# EAGLE design oec (EAGLE 6.2)
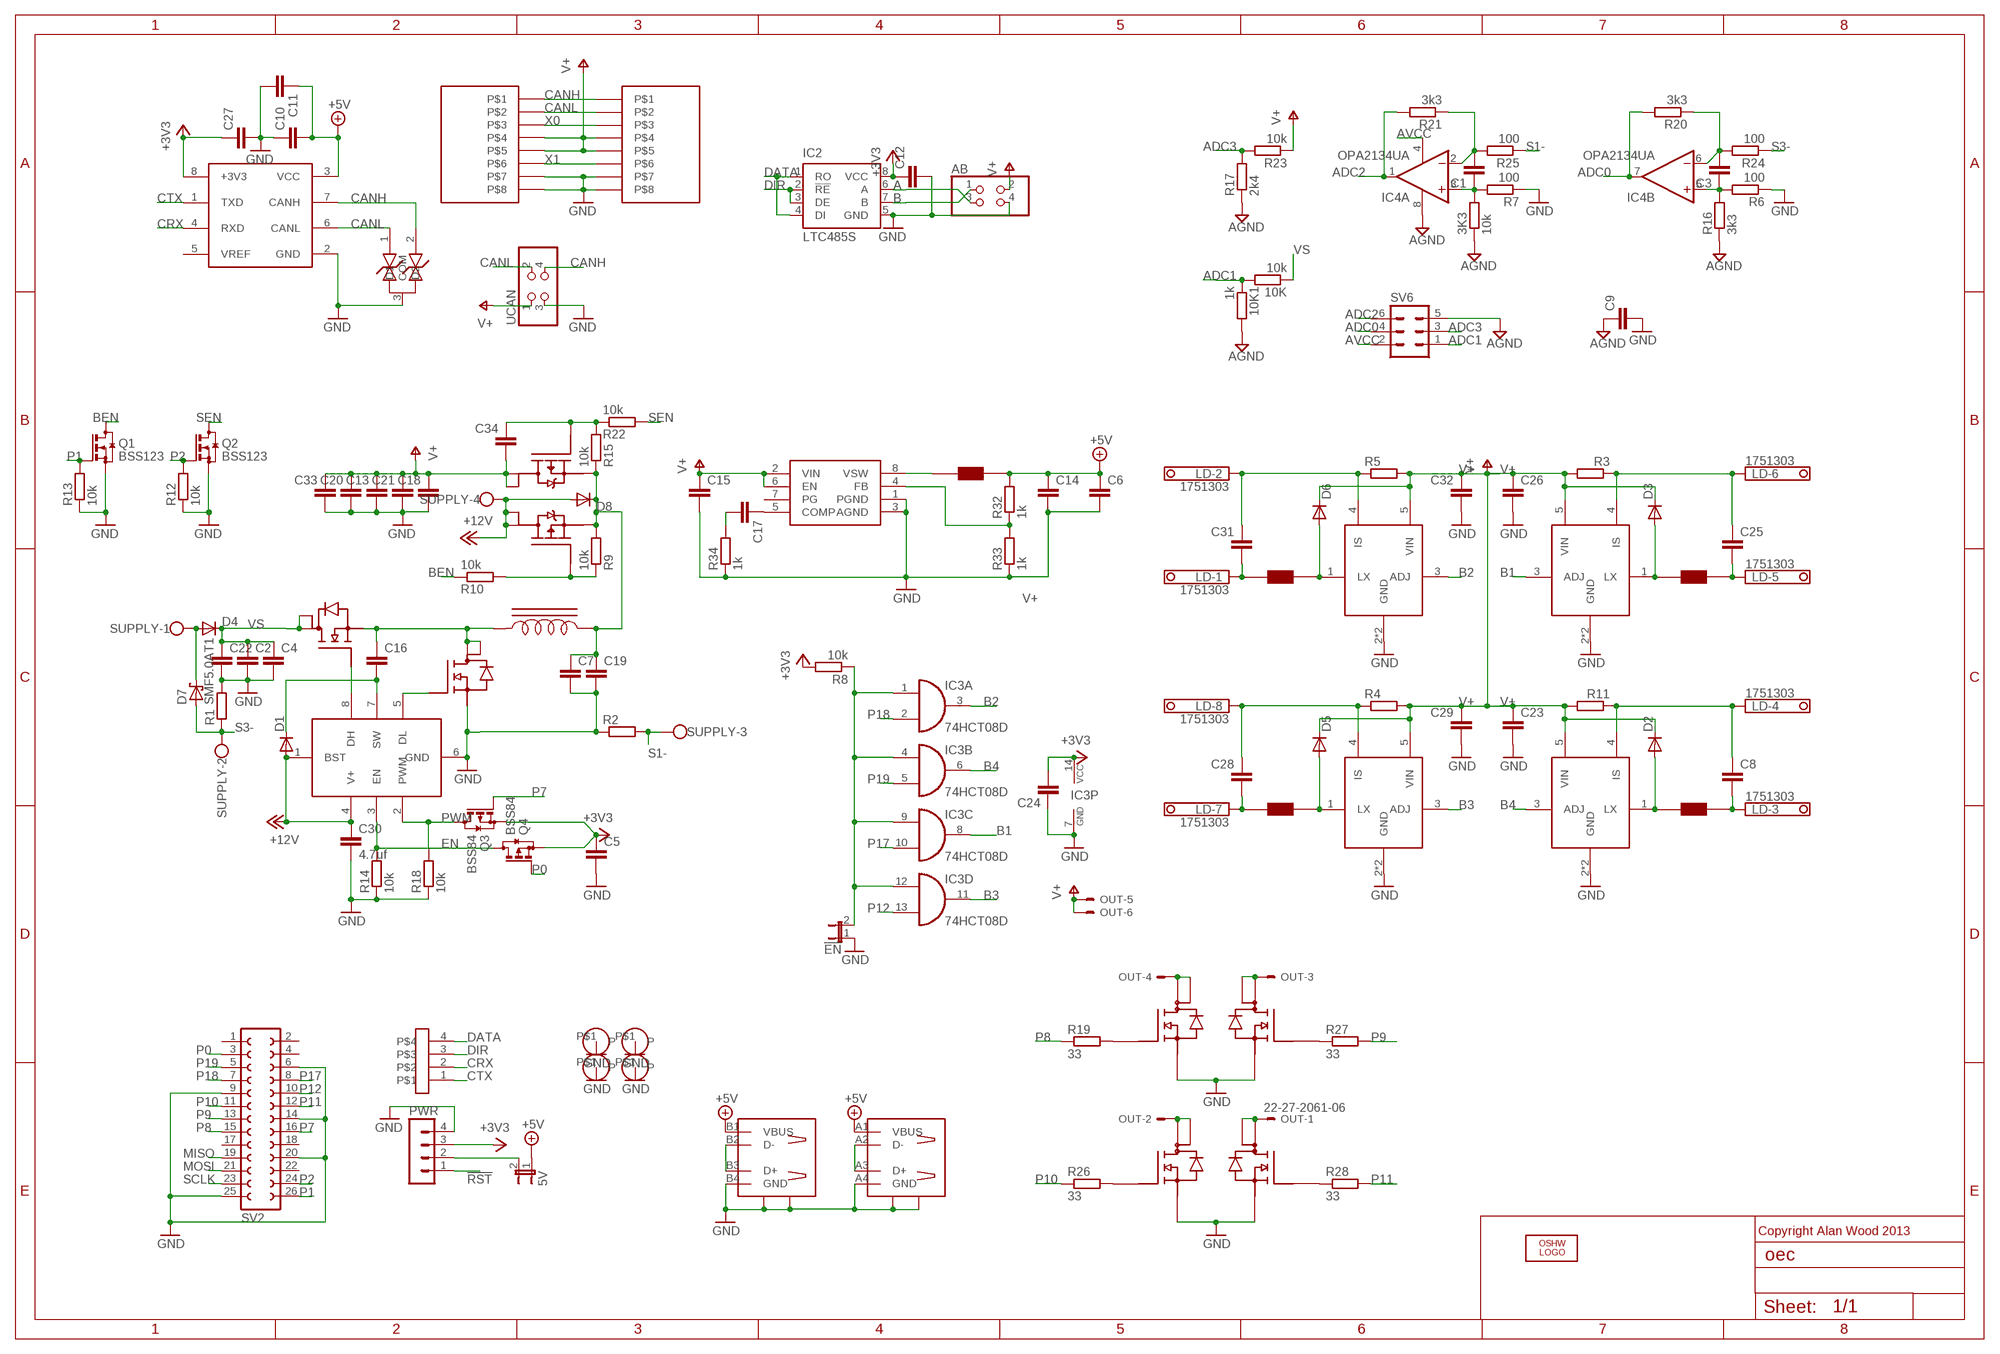
[diagram p0: schematic, sheet 1]

## Parts
3K3  10k  R-EU_R0805  [R0805]
5V  JP1E  [JP1]
10K  10k  R-EU_R0805  [R0805]
10K1  1k  R-EU_R0805  [R0805]
!EN  JP1E  [JP1]
AB  PINHD-2X2/90  [2X02/90]
C1  C-EUC0805  [C0805]
C2  C-EUC1210  [C1210]
C3  C-EUC0805  [C0805]
C4  C-EUC1210  [C1210]
C5  C-EUC0805  [C0805]
C6  C-EUC1210  [C1210]
C7  C-EUC1210  [C1210]
C8  C-EUC1210  [C1210]
C9  C-EUC0805  [C0805]
C10  C-EUC1210  [C1210]
C11  C-EUC1210  [C1210]
C12  C-EUC0805  [C0805]
C13  C-EUC1210  [C1210]
C14  C-EUC1210  [C1210]
C15  C-EUC0805  [C0805]
C16  C-EUC0805  [C0805]
C17  C-EUC0805  [C0805]
C18  C-EUC1210  [C1210]
C19  C-EUC1210  [C1210]
C20  C-EUC1210  [C1210]
C21  C-EUC1210  [C1210]
C22  C-EUC1210  [C1210]
C23  C-EUC1210  [C1210]
C24  C-EUC0805  [C0805]
C25  C-EUC1210  [C1210]
C26  C-EUC1210  [C1210]
C27  C-EUC0805  [C0805]
C28  C-EUC1210  [C1210]
C29  C-EUC1210  [C1210]
C30  4.7uf  C-EUC0805  [C0805]
C31  C-EUC1210  [C1210]
C32  C-EUC1210  [C1210]
C33  C-EUC1210  [C1210]
C34  C-EUC0805  [C0805]
COM  4X1X2.54-HEADER  [2.54_HEADER_4W]
D1  DIODE-SOD123  [SOD123]
D2  DIODE-SOD123  [SOD123]
D3  DIODE-SOD123  [SOD123]
D4  DIODE-DO214AC  [DO214AC]
D5  DIODE-SOD123  [SOD123]
D6  DIODE-SOD123  [SOD123]
D7  SMF5.0AT1  [SOD123FL]
D8  DIODE-DO214AC  [DO214AC]
IC2  LTC485S  [SOIC8]
IC3  74HCT08D  [SO14]
IC4  OPA2134UA  [SO08]
LD  1751303  [1751303]
LOGO1  OSHW_LOGO_FILLX0200-NT  [OSHW_FILLX200_NOTEXT]
OUT  22-27-2061-06  [6410-06]
PWR  MA04-1  [MA04-1]
Q1  BSS123  [SOT23]
Q2  BSS123  [SOT23]
Q3  BSS84  [SOT23]
Q4  BSS84  [SOT23]
R1  R-EU_R1206  [R1206]
R2  R-EU_R1206  [R1206]
R3  R-EU_R1210  [R1210]
R4  R-EU_R1210  [R1210]
R5  R-EU_R1210  [R1210]
R6  100  R-EU_R0805  [R0805]
R7  100  R-EU_R0805  [R0805]
R8  10k  R-EU_R0805  [R0805]
R9  10k  R-EU_R0805  [R0805]
R10  10k  R-EU_R0805  [R0805]
R11  R-EU_R1210  [R1210]
R12  10k  R-EU_R0805  [R0805]
R13  10k  R-EU_R0805  [R0805]
R14  10k  R-EU_R0805  [R0805]
R15  10k  R-EU_R0805  [R0805]
R16  3k3  R-EU_R0805  [R0805]
R17  2k4  R-EU_R0805  [R0805]
R18  10k  R-EU_R0805  [R0805]
R19  33  R-EU_R0603  [R0603]
R20  3k3  R-EU_R0805  [R0805]
R21  3k3  R-EU_R0805  [R0805]
R22  10k  R-EU_R0805  [R0805]
R23  10k  R-EU_R0805  [R0805]
R24  100  R-EU_R0805  [R0805]
R25  100  R-EU_R0805  [R0805]
R26  33  R-EU_R0603  [R0603]
R27  33  R-EU_R0603  [R0603]
R28  33  R-EU_R0603  [R0603]
R32  1k  R-EU_R0805  [R0805]
R33  1k  R-EU_R0805  [R0805]
R34  1k  R-EU_R0805  [R0805]
SUPPLY  W237-4  [W237-4]
SV2  FE13-2  [FE13-2]
SV6  MA03-2  [MA03-2]
U$1  HOLE-2.5MM  [2.5MM-HOLE]
U$2  HOLE-2.5MM  [2.5MM-HOLE]
U$3  HOLE-2.5MM  [2.5MM-HOLE]
U$4  HOLE-2.5MM  [2.5MM-HOLE]
U$5  NCP3170SOIC-8  [SOIC-8-NARROW]
U$6  NTMD4820NR2G  [SOIC-8-NARROW]
U$7  AMIS-3063  [SOIC-8-NARROW]
U$8  NTMD4820NR2G  [SOIC-8-NARROW]
U$9  NRS6045T330MMGK  [TAIKO-YUDEN-6045]
U$12  NCP3420  [SO8]
U$13  RJHSE-5080  [RJ45]
U$14  RJHSE-5080  [RJ45]
U$15  DR127-XXX  [DR127]
U$16  DUAL-USBA-PTH-5787617-1  [DUAL-USBA-PTH]
U$17  NUP2105L  [SOT23]
U$19  SI49255DD  [SO8]
U$20  IRF9358PBF  [SO8]
U$25  ZLED7X20  [SOT89-5]
U$27  ZLED7X20  [SOT89-5]
U$29  ZLED7X20  [SOT89-5]
U$31  ZLED7X20  [SOT89-5]
U$33  NR5040T330M  [TAIKO-YUDEN-5040]
U$34  NR5040T330M  [TAIKO-YUDEN-5040]
U$35  NR5040T330M  [TAIKO-YUDEN-5040]
U$36  NR5040T330M  [TAIKO-YUDEN-5040]
UCAN  PINHD-2X2  [2X02]

## Nets
!RST: PWR.1
+3V3: C5.1 C12.1 C24.2 C27.1 IC2.8(VCC) IC3.14(P:VCC) PWR.3 Q3.2(S) Q4.2(S) R8.2 U$7.8(+3V3)
+5V: 5V.1 C6.1 C10.2 C11.1 C14.1 R32.2 U$7.3(VCC) U$9.2 U$16.A1(VBUS) U$16.B1(VBUS)
+12V: C30.1 D1.A D8.A SUPPLY.4 U$12.1(BST) U$12.4(V+) U$19.7(D) U$19.8(D)
A: AB.3 IC2.6(A)
ADC0: IC4.7(B:OUT) R20.2 SV6.4
ADC1: 10K1.1 10K.2 SV6.1
ADC2: IC4.1(A:OUT) R21.2 SV6.6
ADC3: R17.2 R23.2 SV6.3
AGND: 3K3.1 10K1.2 C9.1 IC4.8(A:V+) R16.1 R17.1 SV6.5
AVCC: IC4.4(A:V-) SV6.2
B: AB.1 IC2.7(B)
B1: IC3.8(C:O) U$27.3(ADJ)
B2: IC3.3(A:O) U$31.3(ADJ)
B3: IC3.11(D:O) U$29.3(ADJ)
B4: IC3.6(B:O) U$25.3(ADJ)
BATTEN: R9.1 R10.2 U$19.2(G)
BEN: Q1.3(D) R10.1
CANH: U$7.7(CANH) U$13.P$1 U$14.P$1 U$17.2(D2) UCAN.4
CANL: U$7.6(CANL) U$13.P$2 U$14.P$2 U$17.1(D1) UCAN.2
CRX: COM.2 U$7.4(RXD)
CTX: COM.1 U$7.1(TXD)
DATA: COM.4 IC2.1(RO) IC2.4(DI)
DIR: COM.3 IC2.2(!RE) IC2.3(DE)
EN: Q4.3(D) R14.2 U$12.3(EN)
GND: !EN.1 AB.4 C2.2 C4.2 C5.2 C6.2 C7.2 C9.2 C10.1 C11.2 C12.2 C13.2 C14.2 C15.2 C18.2 C19.2 C20.2 C21.2 C22.2 C23.2 C24.1 C26.2 C27.2 C29.2 C30.2 C32.2 C33.2 IC2.5(GND) IC3.7(P:GND) PWR.4 Q1.2(S) Q2.2(S) R1.2 R2.1 R6.1 R7.1 R12.1 R13.1 R14.1 R18.1 R33.1 R34.1 SV2.6 SV2.9 SV2.14 SV2.20 SV2.25 U$1.P$1(P) U$2.P$1(P) U$3.P$1(P) U$4.P$1(P) U$5.1(PGND) U$5.3(AGND) U$6.1(S1) U$6.3(S2) U$7.2(GND) U$8.1(S1) U$8.3(S2) U$12.6(GND) U$13.P$7 U$13.P$8 U$14.P$7 U$14.P$8 U$16.A4(GND) U$16.B4(GND) U$16.SH2B(SH) U$16.SH@1A(SH) U$16.SH@1B(SH) U$16.SH@2A(SH) U$17.3(COM) U$20.3(S) U$25.2(GND) U$25.2@1(GND) U$27.2(GND) U$27.2@1(GND) U$29.2(GND) U$29.2@1(GND) U$31.2(GND) U$31.2@1(GND) UCAN.3
ID: C16.1 U$15.P$1(L1) U$20.1(S) U$20.5(D) U$20.6(D)
MISO: SV2.19
MOSI: SV2.21
N$1: C17.1 U$5.5(COMP)
N$2: !EN.2 IC3.1(A:I0) IC3.4(B:I0) IC3.9(C:I0) IC3.12(D:I0) R8.1
N$3: D2.A U$25.1(LX) U$36.1
N$4: R19.2 U$6.2(G1)
N$5: C8.2 LD.3 U$36.2
N$6: U$5.8(VSW) U$9.1
N$7: OUT.4 U$6.7(DP1) U$6.8(D1)
N$8: U$12.8(DH) U$20.2(G)
N$9: R26.2 U$8.2(G1)
N$10: C8.1 LD.4 R11.1 U$25.4(IS)
N$11: D5.A U$29.1(LX) U$35.2
N$12: U$12.5(DL) U$20.4(G)
N$13: C16.2 D1.C U$12.7(SW)
N$14: R28.1 U$8.4(G2)
N$15: OUT.3 U$6.5(DP2) U$6.6(D2)
N$16: R27.1 U$6.4(G2)
N$18: OUT.2 U$8.7(DP1) U$8.8(D1)
N$19: OUT.1 U$8.5(DP2) U$8.6(D2)
N$20: U$16.B2(D-) U$16.B3(D+)
N$22: R32.1 R33.2 U$5.4(FB)
N$23: U$16.A2(D-) U$16.A3(D+)
N$24: D4.A D7.C SUPPLY.1
N$26: 3K3.2 C1.1 IC4.3(A:+IN) R7.2
N$27: C3.1 IC4.5(B:+IN) R6.2 R16.2
N$28: C34.1 R15.2 R22.1 U$19.4(G)
N$29: D3.A U$27.1(LX) U$34.1
N$31: C17.2 R34.2
N$32: C25.2 LD.5 U$34.2
N$38: C1.2 IC4.2(A:-IN) R21.1 R25.2
N$40: C3.2 IC4.6(B:-IN) R20.1 R24.2
N$41: C25.1 LD.6 R3.1 U$27.4(IS)
N$54: C28.2 LD.7 U$35.1
N$56: C28.1 LD.8 R4.1 U$29.4(IS)
N$57: D6.A U$31.1(LX) U$33.2
N$58: C31.2 LD.1 U$33.1
N$59: C31.1 LD.2 R5.1 U$31.4(IS)
P0: Q4.1(G) SV2.3
P1: Q1.1(G) R13.2 SV2.26
P2: Q2.1(G) R12.2 SV2.24
P7: Q3.1(G) SV2.16
P8: R19.1 SV2.15
P9: R27.2 SV2.13
P10: R26.1 SV2.11
P11: R28.2 SV2.12
P12: IC3.13(D:I1) SV2.10
P17: IC3.10(C:I1) SV2.8
P18: IC3.2(A:I1) SV2.7
P19: IC3.5(B:I1) SV2.5
PWM: Q3.3(D) R18.2 U$12.2(PWM)
S1-: R2.2 R25.1 SUPPLY.3
S3-: D7.A R1.1 R24.1 SUPPLY.2
SCLK: SV2.23
SEN: Q2.3(D) R22.2
V+: AB.2 C13.1 C15.1 C18.1 C20.1 C21.1 C23.1 C26.1 C29.1 C32.1 C33.1 C34.2 D2.C D3.C D5.C D6.C OUT.5 OUT.6 R3.2 R4.2 R5.2 R11.2 R23.1 U$5.2(VIN) U$5.6(EN) U$13.P$4 U$13.P$5 U$14.P$4 U$14.P$5 U$19.5(D) U$19.6(D) U$25.5(VIN) U$27.5(VIN) U$29.5(VIN) U$31.5(VIN) UCAN.1
VBUCK: C7.1 C19.1 D8.C R9.2 R15.1 U$15.P$2(L2) U$19.1(S) U$19.3(S)
VISB: 5V.2 PWR.2
VS: 10K.1 C2.1 C4.1 C22.1 D4.C U$20.7(D) U$20.8(D)
X0: U$13.P$3 U$14.P$3
X1: U$13.P$6 U$14.P$6
Unconnected: SV2.1 SV2.2 SV2.4 SV2.17 SV2.18 SV2.22 U$5.7(PG) U$7.5(VREF)

## Notes on the sheet
- Copyright Alan Wood 2013

## Library data of the parts
3K3 10K 10K1 R6-R10 R12-R18 R20-R25 R32-R34 = rcl:R-EU_: RESISTOR, European symbol
5V !EN = jumper:JP1E: JUMPER
AB UCAN = pinhead:PINHD-2X2: PIN HEADER
C1-C34 = rcl:C-EU: CAPACITOR, European symbol
COM = amino:4X1X2.54-HEADER
D1-D6 D8 = diode:DIODE-: DIODE
D7 = diode:SMF5.0AT1: 200 W Transient Voltage Suppressor Source: Data sheet <http://www.onsemi.com/pub_link/Collateral/SMF5.0AT1-D.PDF>
IC2 = linear-technology:LTC485: Low Power RS485 Interface Transceiver Source: http://www.linear.com/pc/downloadDocument.do?navId=H0,C1,C1007,C1017,P2064,D1718; OC_FARNELL: unknown; OC_NEWARK: unknown
IC3 = 74xx-eu:74*08: Quad 2-input AND gate
IC4 = linear:OPA2*: Dual Operational Amplifier Low Power, Single-Supply, Rail-To-Rail Operational Amplifier Source: http://focus.ti.com/lit/ds/symlink/opa2345.pdf http://focus.ti.com .. opa241.pdf http://focus.ti.com/lit/ds/symlink/opa2134.pdf
LD = con-phoenix-350:1751303: MKDS 1/ 8-3,5 Printklemme Nennstrom: 10 A Bemessungsspannung: 160 V Raster: 3,5 mm Polzahl: 8 Montageart: Löten Anschlussart: Schraubanschluss Anschlussrichtung vom Leiter zur Platine: 0° Source: http://eshop.phoenixcontact.com .. .pdf; OC_FARNELL: unknown; OC_NEWARK: unknown
LOGO1 = ohw-logo:OSHW_LOGO_FILL
OUT = con-molex:22-?-06: CONNECTOR wire to board 2.54 mm (.1 inch) pitch header; OC_FARNELL: unknown; OC_NEWARK: unknown
PWR = con-lstb:MA04-1: PIN HEADER; OC_FARNELL: unknown; OC_NEWARK: unknown
Q1 Q2 = transistor-small-signal:BSS123: N-CHANNEL MOS FET
Q3 Q4 = transistor-small-signal:BSS84: P-CHANNEL MOS FET
R1-R5 R11 R19 R26-R28 = resistor:R-EU_: RESISTOR, European symbol
SUPPLY = con-wago-500:W237-4: WAGO SCREW CLAMP; OC_FARNELL: unknown; OC_NEWARK: unknown
SV2 = con-lsta:FE13-2: FEMALE HEADER; OC_FARNELL: unknown; OC_NEWARK: unknown
SV6 = con-lstb:MA03-2: PIN HEADER; OC_FARNELL: unknown; OC_NEWARK: unknown
U$1-U$4 = amino:HOLE-2.5MM
U$5 = amino:NCP3170
U$6 U$8 = amino:NTMD4820NR2G
U$7 = amino:AMIS-3063
U$9 = amino:NRS6045T330MMGK
U$12 = amino:NCP3420
U$13 U$14 = amino:RJHSE-5080
U$15 = amino:DR127-XXX
U$16 = amino:DUAL-USBA-PTH-5787617-1
U$17 = amino:NUP2105L
U$19 = amino:SI49255DD
U$20 = amino:IRF9358PBF
U$25 U$27 U$29 U$31 = amino:ZLED7X20
U$33-U$36 = amino:NR5040T330M

## Board
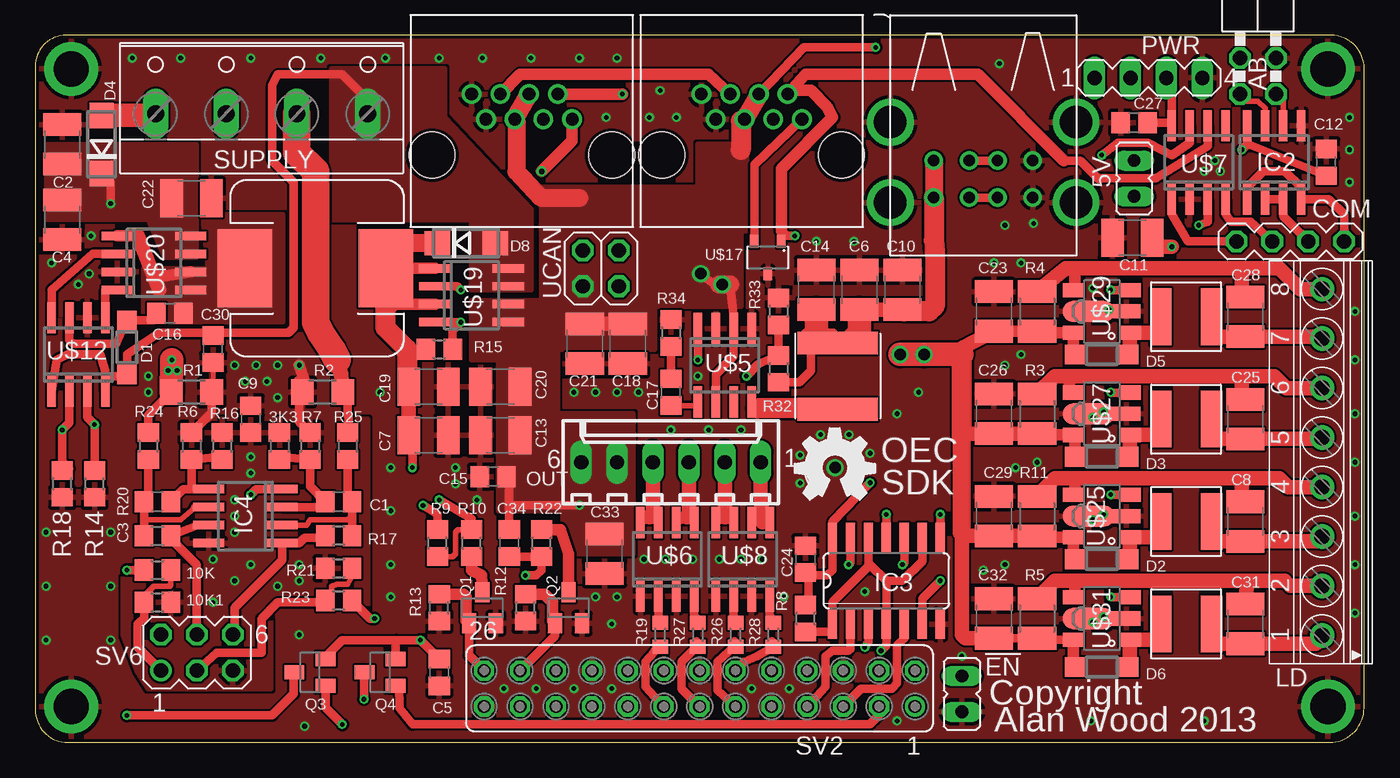
[diagram p1: board, top side]
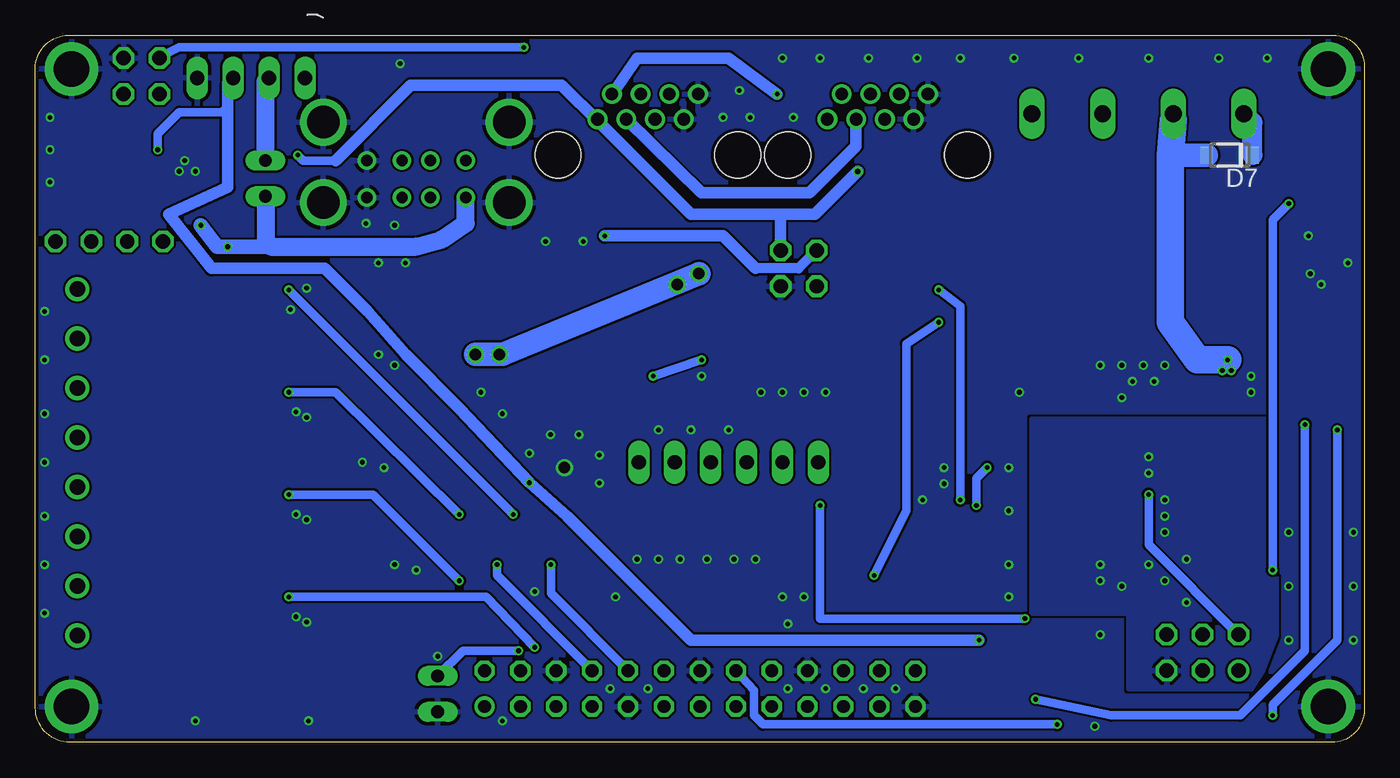
[diagram p2: board, bottom side, seen from below]

Size 94 x 50 mm. Coordinates in mm from the lower left corner, seen from the top.
Outline: 2.29,0 91.54,0 arc90 94,2.46 94,47.66 arc90 91.66,50 2.15,50 arc90 0,47.85 0,2.29 arc90 2.29,0
Copper layers (1*16): Top 0.035mm / dielectric 1.5mm / Bottom 0.035mm
Design rules: minimum track width 6mil, minimum drill 12mil, track to track 6mil, track to pad 6mil, pad to pad 6mil, via to via 6mil, smd to smd 0mil, copper to edge 10mil, drill to drill 10mil, minimum pad ring 10mil, minimum via ring 6mil, stop-mask expansion 2mil, vias tented up to drill 100mil, thermal gap 10mil

### Footprints (pad centres in the part's own frame; a part is rotated, then mirrored left to right if it is on the bottom)
R0805 = smd 1.3 x 1.5: 1 -0.95,0; 2 0.95,0
JP1 = drill 0.914 long: 1 0,-1.27; 2 0,1.27
2X02/90 = drill 1.016 octagon: 1 -1.27,-6.35; 2 -1.27,-3.81; 3 1.27,-6.35; 4 1.27,-3.81
C0805 = smd 1.3 x 1.5: 1 -0.95,0; 2 0.95,0
C1210 = smd 1.6 x 2.7: 1 -1.4,0; 2 1.4,0
2.54_HEADER_4W = drill 1.016 octagon: 1 -3.81,0; 2 -1.27,0; 3 1.27,0; 4 3.81,0
SOD123 = smd 1.4 x 1.4: A 1.9,0; C -1.9,0
DO214AC = smd 1.8 x 1.7: A 2.05,0; C -2.05,0
SOD123FL = smd 0.91 x 1.22: A 1.625,0; C -1.625,0
SOIC8 = smd 0.6 x 2.2: 1 -1.905,-2.6; 2 -0.635,-2.6; 3 0.635,-2.6; 4 1.905,-2.6; 5 1.905,2.6; 6 0.635,2.6; 7 -0.635,2.6; 8 -1.905,2.6
SO14 = smd 0.66 x 2.032: 1 -3.81,-3.073; 2 -2.54,-3.073; 3 -1.27,-3.073; 4 0,-3.073; 5 1.27,-3.073; 6 2.54,-3.073; 7 3.81,-3.073; 8 3.81,3.073; 9 2.54,3.073; 10 1.27,3.073; 11 0,3.073; 12 -1.27,3.073; 13 -2.54,3.073; 14 -3.81,3.073
SO08 = smd 0.6 x 2.2: 1 -1.905,-2.6; 2 -0.635,-2.6; 3 0.635,-2.6; 4 1.905,-2.6; 5 1.905,2.6; 6 0.635,2.6; 7 -0.635,2.6; 8 -1.905,2.6
1751303 = drill 1.1 pad 1.7: 1 -12.25,-0.1; 2 -8.75,-0.1; 3 -5.25,-0.1; 4 -1.75,-0.1; 5 1.75,-0.1; 6 5.25,-0.1; 7 8.75,-0.1; 8 12.25,-0.1
6410-06 = drill 1.016 long: 1 6.35,0; 2 3.81,0; 3 1.27,0; 4 -1.27,0; 5 -3.81,0; 6 -6.35,0
MA04-1 = drill 1.016 long: 1 -3.81,0; 2 -1.27,0; 3 1.27,0; 4 3.81,0
SOT23 = smd 1 x 1.4: 1 -0.95,-1.1; 2 0.95,-1.1; 3 0,1.1
R1206 = smd 1.6 x 1.803: 1 -1.422,0; 2 1.422,0
R1210 = smd 1.6 x 2.7: 1 -1.4,0; 2 1.4,0
R0603 = smd 1 x 1.1: 1 -0.85,0; 2 0.85,0
W237-4 = drill 1.194 long: 1 -7.5,-1.27; 2 -2.5,-1.27; 3 2.5,-1.27; 4 7.5,-1.27
FE13-2 = drill 0.914: 1 -15.24,1.27 | drill 0.914 octagon: 2 -15.24,-1.27; 3 -12.7,1.27; 4 -12.7,-1.27; 5 -10.16,1.27; 6 -10.16,-1.27; 7 -7.62,1.27; 8 -7.62,-1.27; 9 -5.08,1.27; 10 -5.08,-1.27; 11 -2.54,1.27; 12 -2.54,-1.27; 13 0,1.27; 14 0,-1.27; 15 2.54,1.27; 16 2.54,-1.27; 17 5.08,1.27; 18 5.08,-1.27; 19 7.62,1.27; 20 7.62,-1.27; 21 10.16,1.27; 22 10.16,-1.27; 23 12.7,1.27; 24 12.7,-1.27; 25 15.24,1.27; 26 15.24,-1.27
MA03-2 = drill 1.016: 1 -2.54,-1.27 | drill 1.016 octagon: 2 -2.54,1.27; 3 0,-1.27; 4 0,1.27; 5 2.54,-1.27; 6 2.54,1.27
2.5MM-HOLE = drill 2.5 pad 3.81: P$1 0,0
SOIC-8-NARROW = smd 0.6 x 2.2: 1 -1.905,-2.6; 2 -0.635,-2.6; 3 0.635,-2.6; 4 1.905,-2.6; 5 1.905,2.6; 6 0.635,2.6; 7 -0.635,2.6; 8 -1.905,2.6
TAIKO-YUDEN-6045 = smd 1.6 x 5.7: 1 -2.35,0; 2 2.35,0
SO8 = smd 0.6 x 2.2: 1 -1.905,-2.6; 2 -0.635,-2.6; 3 0.635,-2.6; 4 1.905,-2.6; 5 1.905,2.6; 6 0.635,2.6; 7 -0.635,2.6; 8 -1.905,2.6
RJ45 = drill 0.889: P$1 3.556,-1.27; P$2 2.54,0.508; P$3 1.524,-1.27; P$4 0.508,0.508; P$5 -0.508,-1.27; P$6 -1.524,0.508; P$7 -2.54,-1.27; P$8 -3.556,0.508 | hole 3.25: -6.35,-3.81; 6.35,-3.81
DR127 = smd 3.85 x 5.5: P$1 -4.975,0; P$2 4.975,0
DUAL-USBA-PTH = drill 0.8: A1 3.5,2.62; A2 1,2.62; A3 -1,2.62; A4 -3.5,2.62; B1 3.5,0; B2 1,0; B3 -1,0; B4 -3.5,0 | drill 2.3: SH2B 6.57,-2.71; SH@1A -6.57,2.97; SH@1B -6.57,-2.71; SH@2A 6.57,2.97
SOT23' = smd 0.6 x 0.9: 1 -0.95,-1.15; 2 0.95,-1.15; 3 0,1.15
SOT89-5 = smd 1 x 1.5: 1 -1.5,-2; 3 1.5,-2; 4 1.5,2; 5 -1.5,2 | smd 1 x 2: 2 0,-1.727 | smd 1.5 x 3.7: 2@1 0,0.94
TAIKO-YUDEN-5040 = smd 1.5 x 4: 1 -1.8,0; 2 1.8,0
2X02 = drill 1.016 octagon: 1 -1.27,-1.27; 2 -1.27,1.27; 3 1.27,-1.27; 4 1.27,1.27

### Placement (x,y rotation side)
3K3  17.27,20.95 270 top
5V  77.72,39.88 0 top
10K  8.64,12.19 0 top
10K1  8.64,9.91 0 top
!EN  65.53,3.43 0 top
AB  86.49,52.2 0 top
C1  21.46,17.02 0 top
C2  1.91,42.29 90 top
C3  8.64,17.02 180 top
C4  1.91,36.96 270 top
C5  28.57,4.95 270 top
C6  58.29,32 90 top
C7  27.81,21.72 0 top
C8  85.6,15.62 270 top
C9  15.24,22.86 90 top
C10  61.34,32 270 top
C11  77.6,35.69 180 top
C12  91.31,41.02 90 top
C13  32.89,21.72 180 top
C14  55.24,32 90 top
C15  32.38,18.8 180 top
C16  9.53,30.35 180 top
C17  44.96,24.77 90 top
C18  41.91,28.19 270 top
C19  27.81,25.15 0 top
C20  32.89,25.15 180 top
C21  38.86,28.19 270 top
C22  11.05,38.48 0 top
C23  67.82,30.48 90 top
C24  54.48,12.95 270 top
C25  85.6,22.86 270 top
C26  67.82,23.24 90 top
C27  77.72,43.81 180 top
C28  85.6,30.1 270 top
C29  67.82,16 90 top
C30  12.57,27.81 270 top
C31  85.6,8.38 270 top
C32  67.82,8.76 90 top
C33  40.26,13.34 270 top
C34  33.53,14.1 90 top
COM  88.77,35.43 0 top
D1  6.48,27.94 270 top
D2  75.44,12.95 0 top
D3  75.44,20.19 0 top
D4  4.7,42.29 90 top
D5  75.44,27.43 0 top
D6  75.44,5.33 0 top
D7  9.53,41.53 180 bottom
D8  30.48,35.31 0 top
IC2  87.63,41.02 0 top
IC3  60.2,11.43 0 top
IC4  14.86,16 90 top
LD  90.93,19.81 90 top
LOGO1  53.72,17.14 0 top
OUT  44.96,19.81 0 top
PWR  78.74,46.99 0 top
Q1  31.62,9.53 0 top
Q2  37.72,9.53 0 top
Q3  19.43,4.95 90 top
Q4  24.38,4.95 90 top
R1  11.05,24.77 0 top
R2  20.32,24.77 0 top
R3  70.87,23.24 270 top
R4  70.87,30.48 270 top
R5  70.87,8.76 270 top
R6  11.05,20.95 270 top
R7  19.43,20.95 270 top
R8  54.48,8.76 90 top
R9  28.45,14.1 90 top
R10  30.86,14.1 90 top
R11  70.87,16 270 top
R12  34.67,9.53 90 top
R13  28.57,9.53 90 top
R14  4.19,18.29 90 top
R15  28.57,27.81 0 top
R16  13.21,20.95 270 top
R17  21.46,12.32 0 top
R18  1.91,18.29 90 top
R19  44.2,7.62 90 top
R20  8.64,14.61 0 top
R21  21.46,14.61 180 top
R22  35.81,14.1 90 top
R23  21.46,10.03 180 top
R24  8,20.95 270 top
R25  22.1,20.95 270 top
R26  49.53,7.62 90 top
R27  46.86,7.62 270 top
R28  52.2,7.62 270 top
R32  52.58,26.42 270 top
R33  52.58,30.48 270 top
R34  44.96,28.96 270 top
SUPPLY  16,45.72 0 top
SV2  46.99,3.81 180 top
SV6  11.43,6.35 0 top
U$1  2.54,47.62 0 top
U$2  91.44,47.62 0 top
U$3  91.44,2.54 0 top
U$4  2.54,2.54 0 top
U$5  48.77,26.67 180 top
U$6  44.7,12.95 0 top
U$7  82.3,41.02 0 top
U$8  50.04,12.95 0 top
U$9  56.77,25.91 90 top
U$12  3.05,27.43 0 top
U$13  50.67,45.34 0 top
U$14  34.42,45.34 0 top
U$15  19.81,33.53 0 top
U$16  67.06,41.15 180 top
U$17  NUP2105L  [SOT23']  51.82,34.29 180 top
U$19  30.86,31.62 270 top
U$20  8.38,33.91 270 top
U$25  75.44,16 90 top
U$27  75.44,23.24 90 top
U$29  75.44,30.48 90 top
U$31  75.44,8.76 90 top
U$33  81.41,8.38 180 top
U$34  81.41,22.86 0 top
U$35  81.41,30.1 180 top
U$36  81.41,15.62 0 top
UCAN  40.01,33.53 0 top

### Tracks (layer width: path | path; a pad name or v marks a point on that pad's centre or on a via)
+3V3  (via drill 0.33)
  Top 0.61: U$7.8 80.39,44.2 80.39,44.58 80.39,45.09 80.39,46.61 PWR.3 | 80.26,43.75 U$7.8 | IC2.8 85.72,43.05 | 85.72,43.05 85.72,42.35 | 85.72,42.35 85.72,42.29 v85.34,41.91 | Q3.2 20.53,6.05 21.72,7.24 25.53,7.24 | 25.53,7.24 v27.24,7.24 C5.1 | Q4.2 25.48,7.2 25.53,7.24 | C27.1 80.2,43.81 U$7.8 | 54.68,11.81 54.68,9.91 R8.2 | v59.05,18.36 56.39,15.62 IC3.14 56.39,12.19 56.01,11.81 54.68,11.81 | 54.68,11.81 C24.2 | C12.1 85.72,42.35 | 85.72,42.35 85.72,43.05
  Top 0.813: 54.68,11.81 C24.2
  Bottom 0.61: v85.34,41.91 85.34,43.05 83.82,44.58 80.77,44.58 80.39,44.96 80.39,46.61 | 80.39,46.61 PWR.3 80.39,46.61 | v59.05,18.36 56.39,16
  Bottom 0.813: v27.24,7.24 47.62,7.24 56.39,16 v59.05,18.36 64.01,23.62 67.82,27.43 70.48,30.48 73.53,33.53 81.53,33.53 84.58,37.34 80.39,39.24 80.39,46.61
+5V  (via drill 0.33)
  Top 0.305: 57.91,28.57 56.83,28.57 U$9.2
  Top 0.61: U$7.3 82.93,36.83 v82.3,36.58 | R32.2 54.04,25.47 54.86,26.29 54.86,28.57 54.48,28.96 56.45,28.96 U$9.2
  Top 1.016: C11.1 79.63,35.05 v80.39,35.05 | C6.1 C10.2
  Top 1.27: U$16.B1 U$16.A1
  Top 1.422: U$16.A1 63.56,35.5 63.63,34.67 63.63,30.86 63.25,30.48 61.47,30.48 C10.2
  Top 1.676: C14.1 55.24,28.96 54.86,28.57 | C6.1 58.29,28.96 57.91,28.57
  Bottom 1.016: v82.3,36.58 81.15,35.05 | 81.15,35.05 v80.39,35.05 | v80.39,35.05 77.34,35.05 | v80.39,35.05 81.15,35.05
  Bottom 1.27: U$16.A1 63.56,36.7 65.28,35.56 67.06,35.05 77.34,35.05 77.72,35.43 5V.1
+12V
  Top 0.61: U$12.4 4.95,25.91 | 4.95,25.91 4.95,26.29 4.57,27.43 2.29,27.43 1.52,27.05 U$12.1 | 12.19,28.96 11.81,28.96 11.43,28.96 8.76,28.96 6.48,27.44 D1.A 6.34,25.91 4.95,25.91 | 12.19,28.96 17.91,28.96 18.29,29.34 18.29,39.62 16.76,41.15 16.76,46.48 17.14,47.24 21.72,47.24 23.5,45.46 SUPPLY.4 | C30.1 12.38,28.96 12.19,28.96
  pour Top (no thermals): 20.95,47.62 28.96,47.62 28.96,44.2 35.05,37.72 35.05,32 30.86,32 30.86,36.96 20.95,36.96
A
  Top 0.406: IC2.6 88.27,45.34 AB.3
ADC0
  Top 0.61: IC4.7 11.49,15.37 R20.2 9.59,14.42 11.43,12.57 SV6.4
ADC1
  Top 0.406: 10K.2 9.59,11.11 9.53,11.05 8.38,11.05 7.62,10.29 7.62,9.97 10K1.1
  Top 0.61: SV6.1 7.24,6.73 7.24,8.38 7.69,8.83 10K1.1
ADC2
  Top 0.61: SV6.6 14.1,7.75 14.1,9.53 17.46,12.89 IC4.1 18.67,14.1 19.05,14.48 20.39,14.48 R21.2
ADC3
  Top 0.406: R17.2 22.41,11.74 22.1,11.18 21.34,11.18 20.95,11.05 20.95,10.47 R23.2
  Top 0.61: SV6.3 12.83,6.35 16,6.35 16,8.76 17.14,9.91 20.39,9.91 R23.2
AGND  (via drill 0.33)
  other vias: 12.57,12.95 14.1,14.86 12.57,9.91 15.24,19.05 14.1,11.43 14.1,16 14.1,17.14 18.67,12.57 17.14,11.05 18.67,11.43 15.24,12.57 15.24,20.19
  pour Top: 6.22,22.86 23.5,22.86 23.5,9.14 16.64,9.14 16.64,3.81 8,3.81 7.24,4.95 6.22,7.62
  pour Bottom: 6.22,22.86 23.5,22.86 23.5,9.14 16.64,9.14 16.64,3.81 8,3.81 7.24,4.95 6.22,7.62
AVCC  (via drill 0.33)
  Top 0.61: IC4.4 15.62,17.91 v15.24,17.53
  Bottom 0.61: v15.24,17.53 15.24,13.97 SV6.2
B
  Top 0.406: IC2.7 87,44.83 86.49,45.34 85.72,45.34 AB.1
B1  (via drill 0.33)
  Top 0.61: IC3.8 v64.01,16.13 | v76.07,24.77 76.22,24.74 U$27.3
  Bottom 0.61: v64.01,16.13 72.77,24.77 v76.07,24.77
B2  (via drill 0.33)
  Top 0.61: IC3.3 58.93,7.11 v58.67,6.73 | v76.07,10.29 76.22,10.26 U$31.3
  Bottom 0.61: v58.67,6.73 62.1,10.29 v76.07,10.29
B3  (via drill 0.33)
  Top 0.61: IC3.11 v60.2,16.13 | v76.07,32 76.22,31.98 U$29.3
  Bottom 0.61: v60.2,16.13 v76.07,32
B4  (via drill 0.33)
  Top 0.61: IC3.6 62.74,10.16 v64.01,11.43 | v76.07,17.53 76.61,17.5 U$25.3
  Bottom 0.61: v64.01,11.43 70.1,17.53 v76.07,17.53
BATTEN  (via drill 0.33)
  Top 0.406: R10.2 29.91,15.05 29.72,14.86 29.72,13.34 29.53,13.15 R9.1
  Top 0.61: U$19.2 29.84,32.26 v30.1,32 | v28.57,17.14 30.86,15.81 R10.2
  Bottom 0.61: v30.1,32 28.57,30.86 v28.57,17.14
BEN
  Top 0.813: R10.1 30.86,12.57 30.86,12.19 31.58,11.81 Q1.3
CANH  (via drill 0.33, 0.38)
  Top 0.61: U$7.7 81.66,42.42 80.39,41.53 78.68,42.42 76.58,42.42 v75.44,41.53 | U$17.2 50.87,40.83 U$13.P$1
  Top 0.813: U$14.P$1 37.97,42.55 v35.81,40.39
  Bottom 0.61: 72.77,41.15 75.06,41.15 v75.44,41.53
  Bottom 0.813: v35.81,40.39 38.86,37.34 41.15,37.34 | 41.15,37.34 47.62,37.34 54.1,43.81 | 54.1,43.81 U$13.P$1 | 54.1,43.81 56.77,46.48 61.72,46.48 67.44,46.48 72.77,41.15 | UCAN.4 41.27,37.21 41.15,37.34
CANL  (via drill 0.33)
  Top 0.61: U$7.6 82.93,42.16 79.25,39.88 77.54,39.88 75.44,39.88 75.25,39.82 73.91,41.15 72.77,41.15 | U$17.1 52.77,36.2 53.15,35.81 v53.72,35.81 | 53.34,46.1 U$13.P$2
  Top 0.813: U$14.P$2 v41.53,45.85 | 72.77,41.15 66.67,47.24 54.48,47.24 U$13.P$2 | 52.77,36.2 52.77,40.57 56.39,44.2 56.01,44.96 54.86,46.1 53.34,46.1
  Bottom 0.61: 48.39,35.81 v53.72,35.81
  Bottom 0.711: UCAN.2 40.01,33.53 43.05,33.53
  Bottom 0.813: v41.53,45.85 44.96,48.39 45.21,48.39 51.44,48.39 53.09,45.97 U$13.P$2 | 43.05,33.53 45.34,35.81 v53.72,35.81
CRX
  Top 0.61: U$7.4 84.2,37.34 84.58,36.83 85.98,36.83 COM.2
CTX
  Top 0.61: U$7.1 80.39,37.34 81.53,35.43 COM.1
DATA
  Top 0.61: IC2.1 85.72,39.24 86.87,40.39 88.39,40.39 89.53,39.24 IC2.4 91.5,38.42 92.58,37.34 COM.4
DIR
  Top 0.61: IC2.2 IC2.3 88.27,37.21 COM.3
EN  (via drill 0.33)
  Top 0.61: U$12.3 3.68,22.99 v4.19,22.48 R14.2 | v23.24,3.05 23.24,4.91 Q4.3
  Bottom 0.61: v4.19,22.48 4.19,6.48 8.76,1.91 17.91,1.91 v23.24,3.05
GND  (via drill 0.33, 0.81)
  Top 0.305: 12.57,25.65 C30.2
  Top 0.61: R6.1 12.47,23.33 R1.2 | R7.1 18.67,22.67 18.67,23.62 18.67,24.54 R2.1
  Top 0.813: 18.67,25.53 19.05,25.53 v18.67,26.67
  other vias: 55.24,35.43 31.62,48.39 44.2,46.1 45.34,44.2 43.43,44.2 40.39,44.2 41.15,48.39 92.96,44.2 93.34,12.57 70.87,19.81 60.96,23.24 68.58,26.67 68.58,12.57 69.72,27.43 69.34,19.43 67.06,12.19 10.29,48.39 15.24,48.39 20.19,48.39 24.77,48.39 25.15,19.43 0.76,14.86 0.76,11.05 0.76,7.24 93.34,27.05 25.15,12.57 93.34,30.48 93.34,23.24 74.68,1.52 93.34,9.14 24.38,24.77 57.56,21.77 65.53,6.1 55.55,21.77 58.67,10.67 3.81,33.15 93.34,19.81 14.1,26.67 93.34,16 82.68,1.52 39.62,24.77 59.05,20.45 83.44,41.15 70.61,36.7 15.62,26.67 14.86,25.53 17.14,26.67 16.38,25.53 6.86,48.39 38.1,24.77 49.91,22.1 42.67,24.77 56.57,19.43 54.1,20.32 75.95,30.61 74.8,32.13 75.56,8.89 75.56,16.13 74.8,15.75 74.8,8.51 75.56,23.37 74.8,22.99 25.15,16.38 41.15,24.77 35.05,48.39 28.57,48.39 82.68,40.39 83.82,40.39 38.48,48.39 68.2,48.01 35.43,3.81 38.1,3.81 40.77,3.81 33.15,3.81 50.67,3.81 53.34,3.81 60.96,1.52 67.82,33.91 69.72,33.91 54.1,18.34 40.77,8.38 68.58,36.58 62.48,24.77 47.62,22.1 44.96,22.1 46.86,25.91 57.91,35.43 29.72,19.43 29.72,18.29 39.62,10.29 41.15,10.29 44.58,12.95 46.48,12.95 51.44,12.95 52.96,10.29 48.39,12.95 49.91,12.95 43.05,12.95 1.14,33.91 3.05,32.38 17.14,24.38 3.94,35.81 31.24,17.14 25.15,10.29 8,25.91 8,24.77 5.33,14.86 5.33,11.05 5.33,7.24 19.05,1.14 18.67,7.62 92.96,41.91 92.96,39.62
  pour Top (rank 2): 0,50 93.86,50 94.11,0 0,0
  pour Bottom (rank 2): 0,50 93.86,50 94.11,0 0,0
ID
  Top 0.61: 14.1,32 14.1,33.53 14.47,33.9
  Top 0.813: 13.31,32 U$15.P$1 | U$20.1 7.24,35.81 | 8.76,32 8.64,32.89 U$20.6
  Top 1.016: 7.24,35.81 8.76,32
  Top 1.676: 14.47,33.9 U$15.P$1
  pour Top (no thermals): 7.62,33.53 12.19,33.53 11.81,37.34 17.53,37.34 17.53,29.72 7.62,29.72
N$1
  Top 0.406: U$5.5 46.86,23.82 C17.1
N$2  (via drill 0.33)
  Top 0.61: IC3.12 58.93,12.7 59.05,12.57 | 59.05,12.57 60.2,11.43 | 60.2,11.43 IC3.4 60.2,6.86 v59.82,6.48 | IC3.9 62.74,12.83 61.34,11.43 60.2,11.43 | R8.1 56.39,7.81 IC3.1 56.39,9.91 59.05,12.57
  Bottom 0.61: v59.82,6.48 63.75,6.48 !EN.2
N$3
  Top 1.016: U$36.1 79.73,14.48 79.63,14.48 79.63,14.5 U$25.1 77.44,12.95 D2.A
N$4
  Top 0.61: U$6.2 44.07,8.98 R19.2
N$5
  Top 1.016: U$36.2 83.33,14.48 83.44,14.48 83.44,14.22 C8.2 90.82,14.22 LD.3
N$6
  Top 0.406: 51.05,23.62 50.74,24 U$5.8
  Top 1.016: U$9.1 54.17,23.62
  Top 1.422: 54.17,23.62 51.05,23.62
N$7
  Top 0.61: U$6.8 43.43,15.94 U$6.7
  Top 1.016: OUT.4 43.69,16.26 43.43,16 43.43,15.94
N$8
  Top 0.61: U$20.2 4.06,34.54 1.14,32 U$12.8
N$9
  Top 0.61: U$8.2 49.4,8.98 R26.2
N$10
  Top 0.813: U$25.4 73.53,17.6 73.53,18.67
  Top 1.016: R11.1 72.13,18.67 73.53,18.67 85.34,18.67 | 85.34,18.67 88.01,18.67 88.62,18.06 LD.4 | C8.1 85.34,17.02 85.34,18.67
N$11
  Top 1.016: D5.A 77.44,27.43 U$29.1 79.73,28.98 U$35.2
N$12
  Top 0.61: U$12.5 4.95,32 U$20.4
N$13
  Top 0.61: U$12.7 2.41,28.45 2.67,28.19 5.71,28.19 D1.C 8.38,29.84 8.38,30.16 C16.2
N$14
  Top 0.61: U$8.4 51.94,9.11 R28.1
N$15
  Top 0.61: U$6.6 46.1,15.94 U$6.5
  Top 1.016: OUT.3 46.23,16.13 46.1,16 46.1,15.94
N$16
  Top 0.61: U$6.4 46.61,9.11 R27.1
N$18
  Top 0.61: U$8.8 48.77,15.94 U$8.7
  Top 1.016: OUT.2 48.77,15.94
N$19
  Top 0.61: U$8.6 51.44,15.55 U$8.5
  Top 1.016: OUT.1 51.31,17.59 51.44,15.55
N$20
  Top 0.61: U$16.B2 U$16.B3
N$22  (via drill 0.33)
  Top 0.61: R33.2 R32.1 51.12,26.74 v50.29,25.91 | U$5.4 46.86,27.43 v46.86,27.05
  Bottom 0.61: v46.86,27.05 v50.29,25.91
N$23
  Top 0.61: U$16.A2 U$16.A3
N$24
  Top 1.676: D4.A 8.39,44.34 SUPPLY.1
  Bottom 1.422: D7.C 7.9,43.85 SUPPLY.1
N$26
  Top 0.61: 3K3.2 18.03,20.13 R7.2 19.43,18.1 C1.1 20.13,16.64 IC4.3
N$27
  Top 0.61: R16.2 12.38,20.13 R6.2 11.05,17.91 | IC4.5 11.05,17.91 | 11.05,17.91 10.47,17.91 C3.1
N$28  (via drill 0.33)
  Top 0.61: U$19.4 29.72,29.72 v30.1,29.72 29.52,29.14 R15.2 | v34.67,11.81 35.43,11.81 35.81,12.19 R22.1 C34.1
  Bottom 0.61: v30.1,29.72 32.38,28.19 32.38,16.38 v34.67,11.81
N$29
  Top 1.016: D3.A 77.44,20.19 U$27.1 79.73,21.74 U$34.1
N$31
  Top 0.61: C17.2 R34.2
N$32
  Top 1.016: U$34.2 83.33,21.46 C25.2 91.06,21.46 LD.5
N$38
  Top 0.406: IC4.2 19.18,15.37 19.43,15.75 22.03,15.75 22.41,16
  Top 0.61: R21.1 22.41,16 C1.2 22.1,17.33 R25.2
N$40
  Top 0.406: 11.3,16.64 10.29,15.75 7.69,15.75
  Top 0.61: R20.1 7.69,15.75 C3.2 8,17.33 R24.2 | IC4.6 11.3,16.64
N$41
  Top 0.813: U$27.4 73.15,25.03 73.15,25.91
  Top 1.016: R3.1 72.13,25.91 73.15,25.91 85.34,25.91 | 85.34,25.91 87.63,25.91 88.48,25.06 LD.6 | C25.1 85.34,24.26 85.34,25.91
N$54
  Top 1.016: U$35.1 83.33,28.7 C28.2 91.02,28.7 LD.7
N$56
  Top 0.813: U$29.4 73.53,32.08 73.53,33.53
  Top 1.016: R4.1 72.89,33.53 73.53,33.53 85.34,33.53 | 85.34,33.53 88.01,33.53 89.48,32.06 LD.8 | C28.1 85.34,31.5 85.34,33.53
N$57
  Top 1.016: U$33.2 79.63,8.28 79.63,7.24 79.61,7.26 U$31.1 77.44,5.33 D6.A
N$58
  Top 1.016: LD.1 90.58,6.98 C31.2 83.7,6.98 83.44,7.24 83.44,8.28 U$33.1
N$59
  Top 0.813: U$31.4 73.53,10.36 73.53,11.43
  Top 1.016: R5.1 72.13,11.43 73.53,11.43 85.72,11.43 | 85.72,11.43 88.39,11.43 88.76,11.06 LD.2 | C31.1 85.72,11.43
P0
  Top 0.61: 59.69,1.91 59.37,1.59 | 59.37,1.59 59.05,1.27 26.67,1.27 25.78,2.41 25.72,4 Q4.1 | SV2.3 59.69,1.91 | 59.69,1.91 59.37,1.59
P1
  Top 0.61: Q1.1 30.67,6.16 SV2.26
  Top 0.813: R13.2 30.29,10.47 30.48,10.29 30.48,8.62 Q1.1
P2
  Top 0.61: Q2.1 36.77,7.56 SV2.24
  Top 0.813: R12.2 36.01,10.47 36.58,9.91 36.58,8.62 Q2.1
P7  (via drill 0.33)
  Top 0.61: v21.72,1.27 20.57,2.41 20.53,2.6 Q3.1
  Bottom 0.61: v21.72,1.27 42.55,1.27 43.18,1.91 43.18,3.68 SV2.16
P8
  Top 0.61: 44.07,6.73 43.18,5.71 43.18,3.94 SV2.15 | 44.07,6.73 43.81,6.48 44.07,6.73 | 44.07,6.73 44.2,6.86 R19.1
P9
  Top 0.61: SV2.13 45.72,3.81 45.72,5.71 46.61,6.6 46.77,7.15 R27.2
P10
  Top 0.61: SV2.11 48.26,3.68 48.26,5.71 49.4,6.73 49.44,7.15 R26.1
P11
  Top 0.61: SV2.12 50.16,5.71 51.05,6.1 51.94,6.6 52.11,7.15 R28.2
P12  (via drill 0.33)
  Top 0.61: v57.53,12.57 57.66,12.7 IC3.13
  Bottom 0.61: SV2.10 57.53,10.54 v57.53,12.57
P17  (via drill 0.33)
  Top 0.61: v61.34,12.57 61.47,12.7 IC3.10
  Bottom 0.61: SV2.8 61.34,11.81 v61.34,12.57
P18
  Top 0.61: SV2.7 55.88,3.94 55.88,6.1 56.39,6.48 57.53,6.48 57.66,6.6 IC3.2
P19
  Top 0.61: SV2.5 58.42,3.81 60.58,3.81 60.96,4.19 60.96,6.86 61.47,7.37 IC3.5
PWM  (via drill 0.33)
  Top 0.61: R18.2 2.41,19.36 1.91,19.87 v1.91,22.1 2.41,22.61 U$12.2 | v6.48,1.91 16.76,1.91 18.29,3.43 18.29,4.91 Q3.3
  Bottom 0.61: v1.91,22.1 1.91,7.24 6.48,2.67 v6.48,1.91
S1-
  Top 0.61: R25.1 22.16,22.93 22.1,23.24 22.1,24.66 R2.2
  Top 1.016: 21.34,27.05 21.61,26.01 R2.2
  Top 1.93: SUPPLY.3 18.5,41.7 19.81,40.39 19.81,29.72 20.19,28.96 20.95,27.81 21.34,27.05
S3-  (via drill 0.33)
  Top 0.61: v10.03,26.29 9.53,26.54 | 9.53,26.54 v9.65,27.05 9.53,26.54 | v9.4,26.29 9.53,26.54 | R24.1 8,23.14 R1.1
  Top 1.676: v9.65,27.05 R1.1
  Bottom 1.676: SUPPLY.2 13.5,43.98 | D7.A 13.72,41.53
  Bottom 1.93: v9.65,27.05 11.81,27.05 13.72,29.72 13.72,41.15 13.72,41.53 13.5,43.98
SEN
  Top 0.813: R22.2 37.15,15.05 37.72,13.34 Q2.3
V+  (via drill 0.33, 0.81)
  Top 0.61: U$31.5 70.97,7.26 R5.2 C32.1 | U$5.6 48.13,26.04 49.15,27.05 49.4,27.3 U$5.2 49.4,30.23 49.15,32.38 | C34.2 33.53,16.76 | 33.53,16.76 33.53,18.6 C15.1 | v47.07,33.15 48.01,32.38 48.39,32.38 | v38.48,16.76 33.53,16.76 | R23.1 23.68,8.76 v24,8.76 | v59.44,49.15 54.36,49.15 U$13.P$4
  Top 0.813: D6.C 73.44,5.43 U$31.5 | D2.C 73.44,13.05 U$25.5 70.97,14.5 R11.2 | D3.C 73.54,21.64 U$27.5 70.97,21.74 R3.2 | D5.C 73.44,27.53 U$29.5 70.97,28.98 R4.2 C23.1
  Top 1.016: C23.1 65.66,27.94 65.53,27.43 | C32.1 65.79,7.36 65.53,7.62 65.53,14.86 65.79,14.6 C29.1 R11.2 | 65.53,21.72 65.66,21.84 C26.1 R3.2 | C21.1 C18.1
  Top 1.27: U$14.P$4 U$14.P$5 34.03,43.95 34.03,40.39 35.81,38.48 38.48,38.48 | U$13.P$4 U$13.P$5 | 65.53,14.86 65.53,21.72 | 48.39,32.38 49.15,32.38
  Top 1.422: 65.53,21.72 65.53,27.43 | U$13.P$5 49.91,43.94 49.91,41.91
  Top 1.676: 65.53,27.43 v62.87,27.43 v61.16,27.43
  Bottom 0.406: 85.34,48.39 AB.2
  Bottom 0.61: v24,8.76 38.48,8.76 v38.48,16.76 | 85.34,48.39 83.82,49.15 v59.44,49.15
  Bottom 1.676: v61.16,27.43 60.96,27.43 | 60.96,27.43 v47.07,33.15 | 60.96,27.43 v61.16,27.43 | v61.16,27.43 v62.87,27.43 v61.16,27.43
  other vias: 48.59,32.38
  pour Top (no thermals): 30.86,31.24 35.81,31.24 35.81,39.24 46.86,39.24 46.86,42.29 50.29,42.29 50.29,36.2 49.91,36.2 49.91,30.86 43.81,30.86 43.81,27.81 36.96,27.81 36.96,23.24 42.29,23.24 42.29,13.34 37.34,13.34 37.34,16.38 32.77,16.38 32.77,27.05 30.86,27.05
VBUCK  (via drill 0.33)
  Top 0.61: R9.2 28.45,16.13 v27.43,16.76 | R15.1 26.29,27.81 26.29,27.82 | 24.77,29.34 24.77,30.2 25.55,30.99 | v26.67,19.43 26.67,21.46 C7.1
  Top 0.813: U$19.3 25.55,30.99 | U$19.1 U$15.P$2 | 24.79,35.31 U$15.P$2 | 25.53,34.27 U$15.P$2
  Top 0.914: 25.42,32.89 25.16,33.16 U$15.P$2
  Top 1.016: C19.1 C7.1
  Top 1.27: D8.C 24.79,35.31 | 25.53,34.29 25.53,34.27
  Top 1.422: 25.53,34.27 25.53,34.29 | 25.15,33.15 25.16,33.16 | C19.1 26.29,27.82 24.77,29.34 24.77,33.51 U$15.P$2
  Bottom 0.61: v27.43,16.76 27.43,18.67 v26.67,19.43
VISB
  Bottom 1.27: 5V.2 77.72,46.74 PWR.2
VS  (via drill 0.33)
  Top 0.61: 10K.1 v6.48,12.19 | v5.33,38.1 5.33,39.61 D4.C
  Bottom 0.61: v6.48,12.19 6.48,36.96 v5.33,38.1
  pour Top (no thermals): 11.43,42.29 11.43,34.29 9.14,34.29 8,36.96 0.76,36.96 0.76,42.29
X0
  Bottom 0.813: U$14.P$3 35.94,42.16 39.24,38.86 46.86,38.86 U$13.P$3
X1
  Top 0.813: U$14.P$6 34.29,47.24 47.62,47.24 U$13.P$6

### Text on the board
tPlace: OEC | SDK | Copyright | Alan Wood 2013